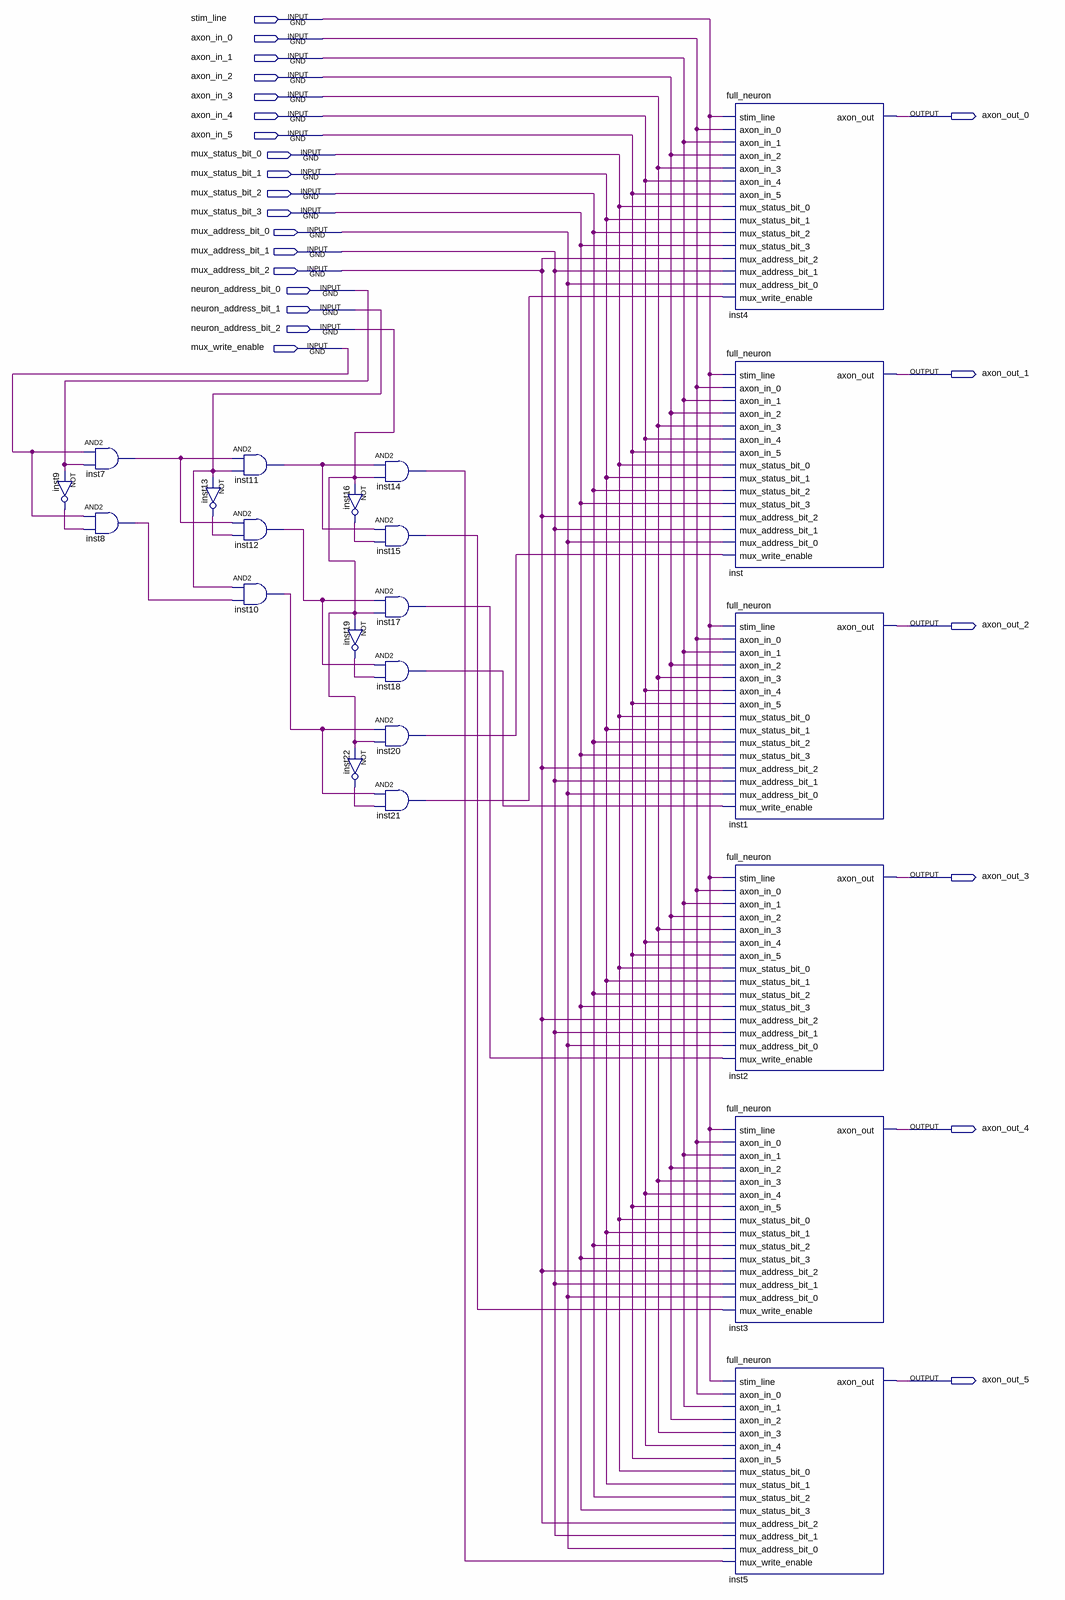
[diagram p0: schematic sheet]
// Quartus schematic 6_neuron_net_layer.bdf as structural Verilog: 22 symbols, 24 pins
module \6_neuron_net_layer  (
  input  stim_line,
  input  axon_in_0,
  input  axon_in_1,
  input  axon_in_2,
  input  axon_in_3,
  input  axon_in_4,
  input  axon_in_5,
  input  mux_status_bit_0,
  input  mux_status_bit_1,
  input  mux_status_bit_2,
  input  mux_status_bit_3,
  input  mux_address_bit_0,
  input  mux_address_bit_1,
  input  mux_address_bit_2,
  input  neuron_address_bit_0,
  input  neuron_address_bit_1,
  input  neuron_address_bit_2,
  input  mux_write_enable,
  output axon_out_0,
  output axon_out_1,
  output axon_out_2,
  output axon_out_3,
  output axon_out_4,
  output axon_out_5
);

  wire inst7_out, inst8_out, inst9_out, inst10_out, inst11_out, inst12_out, inst13_out, inst14_out,
       inst15_out, inst16_out, inst17_out, inst18_out, inst19_out, inst20_out, inst21_out, inst22_out;

  not inst9 (inst9_out, neuron_address_bit_0);
  and inst7 (inst7_out, mux_write_enable, neuron_address_bit_0);
  and inst8 (inst8_out, mux_write_enable, inst9_out);
  not inst13 (inst13_out, neuron_address_bit_1);
  and inst11 (inst11_out, inst7_out, neuron_address_bit_1);
  and inst12 (inst12_out, inst7_out, inst13_out);
  and inst10 (inst10_out, neuron_address_bit_1, inst8_out);
  and inst14 (inst14_out, inst11_out, neuron_address_bit_2);
  not inst16 (inst16_out, neuron_address_bit_2);
  and inst15 (inst15_out, inst11_out, inst16_out);
  and inst17 (inst17_out, inst12_out, neuron_address_bit_2);
  not inst19 (inst19_out, neuron_address_bit_2);
  and inst18 (inst18_out, inst12_out, inst19_out);
  and inst20 (inst20_out, inst10_out, neuron_address_bit_2);
  not inst22 (inst22_out, neuron_address_bit_2);
  and inst21 (inst21_out, inst10_out, inst22_out);
  full_neuron inst4 (
    .stim_line(stim_line), .axon_in_0(axon_in_0), .axon_in_1(axon_in_1), .axon_in_2(axon_in_2),
    .axon_in_3(axon_in_3), .axon_in_4(axon_in_4), .axon_in_5(axon_in_5), .mux_status_bit_0(mux_status_bit_0),
    .mux_status_bit_1(mux_status_bit_1), .mux_status_bit_2(mux_status_bit_2),
    .mux_status_bit_3(mux_status_bit_3), .mux_address_bit_2(mux_address_bit_2),
    .mux_address_bit_1(mux_address_bit_1), .mux_address_bit_0(mux_address_bit_0),
    .mux_write_enable(inst21_out), .axon_out(axon_out_0));
  full_neuron inst (
    .stim_line(stim_line), .axon_in_0(axon_in_0), .axon_in_1(axon_in_1), .axon_in_2(axon_in_2),
    .axon_in_3(axon_in_3), .axon_in_4(axon_in_4), .axon_in_5(axon_in_5), .mux_status_bit_0(mux_status_bit_0),
    .mux_status_bit_1(mux_status_bit_1), .mux_status_bit_2(mux_status_bit_2),
    .mux_status_bit_3(mux_status_bit_3), .mux_address_bit_2(mux_address_bit_2),
    .mux_address_bit_1(mux_address_bit_1), .mux_address_bit_0(mux_address_bit_0),
    .mux_write_enable(inst20_out), .axon_out(axon_out_1));
  full_neuron inst1 (
    .stim_line(stim_line), .axon_in_0(axon_in_0), .axon_in_1(axon_in_1), .axon_in_2(axon_in_2),
    .axon_in_3(axon_in_3), .axon_in_4(axon_in_4), .axon_in_5(axon_in_5), .mux_status_bit_0(mux_status_bit_0),
    .mux_status_bit_1(mux_status_bit_1), .mux_status_bit_2(mux_status_bit_2),
    .mux_status_bit_3(mux_status_bit_3), .mux_address_bit_2(mux_address_bit_2),
    .mux_address_bit_1(mux_address_bit_1), .mux_address_bit_0(mux_address_bit_0),
    .mux_write_enable(inst18_out), .axon_out(axon_out_2));
  full_neuron inst2 (
    .stim_line(stim_line), .axon_in_0(axon_in_0), .axon_in_1(axon_in_1), .axon_in_2(axon_in_2),
    .axon_in_3(axon_in_3), .axon_in_4(axon_in_4), .axon_in_5(axon_in_5), .mux_status_bit_0(mux_status_bit_0),
    .mux_status_bit_1(mux_status_bit_1), .mux_status_bit_2(mux_status_bit_2),
    .mux_status_bit_3(mux_status_bit_3), .mux_address_bit_2(mux_address_bit_2),
    .mux_address_bit_1(mux_address_bit_1), .mux_address_bit_0(mux_address_bit_0),
    .mux_write_enable(inst17_out), .axon_out(axon_out_3));
  full_neuron inst3 (
    .stim_line(stim_line), .axon_in_0(axon_in_0), .axon_in_1(axon_in_1), .axon_in_2(axon_in_2),
    .axon_in_3(axon_in_3), .axon_in_4(axon_in_4), .axon_in_5(axon_in_5), .mux_status_bit_0(mux_status_bit_0),
    .mux_status_bit_1(mux_status_bit_1), .mux_status_bit_2(mux_status_bit_2),
    .mux_status_bit_3(mux_status_bit_3), .mux_address_bit_2(mux_address_bit_2),
    .mux_address_bit_1(mux_address_bit_1), .mux_address_bit_0(mux_address_bit_0),
    .mux_write_enable(inst15_out), .axon_out(axon_out_4));
  full_neuron inst5 (
    .stim_line(stim_line), .axon_in_0(axon_in_0), .axon_in_1(axon_in_1), .axon_in_2(axon_in_2),
    .axon_in_3(axon_in_3), .axon_in_4(axon_in_4), .axon_in_5(axon_in_5), .mux_status_bit_0(mux_status_bit_0),
    .mux_status_bit_1(mux_status_bit_1), .mux_status_bit_2(mux_status_bit_2),
    .mux_status_bit_3(mux_status_bit_3), .mux_address_bit_2(mux_address_bit_2),
    .mux_address_bit_1(mux_address_bit_1), .mux_address_bit_0(mux_address_bit_0),
    .mux_write_enable(inst14_out), .axon_out(axon_out_5));
endmodule
